# EAGLE design bombclock_1.0.1 (EAGLE 7.3.0)
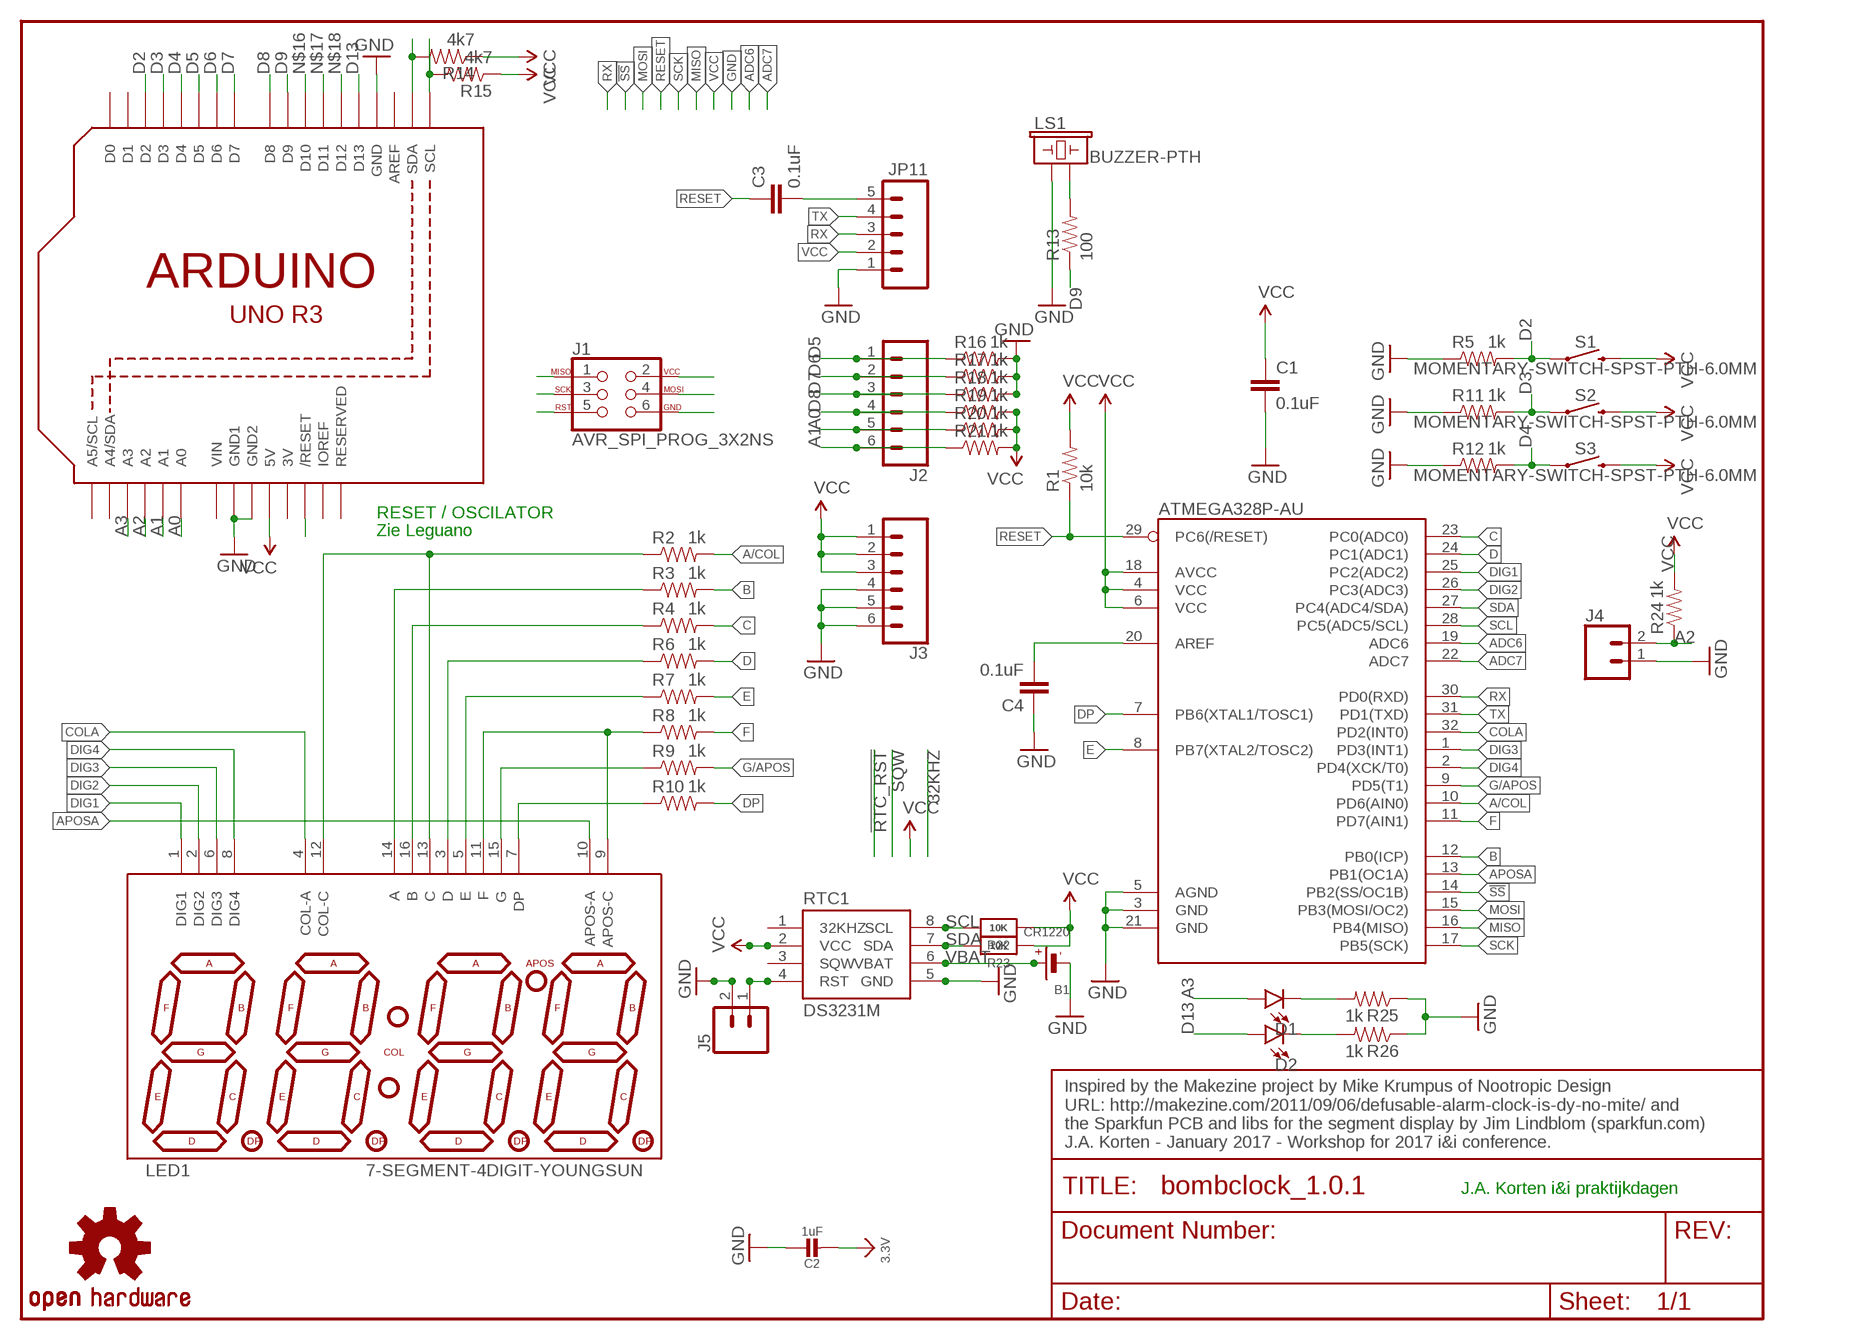
[diagram p0: schematic, sheet 1]

## Parts
ATMEGA328P-AU  ATMEGA328P-AU  ATMEGA168  [TQFP32-08]
B1  CR1220  BATTERYCR1220_SMT  [CR1220]
C1  0.1uF  CAP0402-CAP  [0402-CAP]
C2  1uF  CAP_CERAMIC0805-NOOUTLINE  [0805-NO]
C3  0.1uF  CAP0402-CAP  [0402-CAP]
C4  0.1uF  CAP0402-CAP  [0402-CAP]
D1  LED5MM  [LED_5MM]
D2  LED5MM  [LED_5MM]
J1  AVR_SPI_PROG_3X2NS  [2X3-NS]
J2  CONN_06SILK_FEMALE_PTH  [1X06]
J3  CONN_06SILK_FEMALE_PTH  [1X06]
J4  CONN_02  [1X02]
J5  CONN_02  [1X02]
JP11  M05PTH-NS  [1X05_NO_SILK]
LED1  7-SEGMENT-4DIGIT-YOUNGSUN  [7-SEGMENT-4DIGIT-YOUNGSUN]
LS1  BUZZER-PTH  [BUZZER-12MM]
R1  10k  RESISTOR0402-RES  [0402-RES]
R2  1k  RESISTOR0402-RES  [0402-RES]
R3  1k  RESISTOR0402-RES  [0402-RES]
R4  1k  RESISTOR0402-RES  [0402-RES]
R5  1k  RESISTOR0402-RES  [0402-RES]
R6  1k  RESISTOR0402-RES  [0402-RES]
R7  1k  RESISTOR0402-RES  [0402-RES]
R8  1k  RESISTOR0402-RES  [0402-RES]
R9  1k  RESISTOR0402-RES  [0402-RES]
R10  1k  RESISTOR0402-RES  [0402-RES]
R11  1k  RESISTOR0402-RES  [0402-RES]
R12  1k  RESISTOR0402-RES  [0402-RES]
R13  100  RESISTOR0402-RES  [0402-RES]
R14  4k7  RESISTOR0402-RES  [0402-RES]
R15  4k7  RESISTOR0402-RES  [0402-RES]
R16  1k  RESISTOR0402-RES  [0402-RES]
R17  1k  RESISTOR0402-RES  [0402-RES]
R18  1k  RESISTOR0402-RES  [0402-RES]
R19  1k  RESISTOR0402-RES  [0402-RES]
R20  1k  RESISTOR0402-RES  [0402-RES]
R21  1k  RESISTOR0402-RES  [0402-RES]
R22  10K  RESISTOR0805_NOOUTLINE  [0805-NO]
R23  10K  RESISTOR0805_NOOUTLINE  [0805-NO]
R24  1k  RESISTOR0402-RES  [0402-RES]
R25  1k  RESISTOR0402-RES  [0402-RES]
R26  1k  RESISTOR0402-RES  [0402-RES]
RTC1  DS3231M  [SO08]
S1  MOMENTARY-SWITCH-SPST-PTH-6.0MM  [TACTILE_SWITCH_PTH_6.0MM]
S2  MOMENTARY-SWITCH-SPST-PTH-6.0MM  [TACTILE_SWITCH_PTH_6.0MM]
S3  MOMENTARY-SWITCH-SPST-PTH-6.0MM  [TACTILE_SWITCH_PTH_6.0MM]
U1  ARDUINOR3-DIMENSION  [ARDUINOR3]
U$4  OSHW-LOGOS  [OSHW-LOGO-S]

## Nets
3.3V: C2.2
!SS: ATMEGA328P-AU.14(PB2(SS/OC1B))
A0: J2.5 R20.1 U1.A0
A1: J2.6 R21.1 U1.A1
A2: J4.2 R24.1 U1.A2
A3: D1.A U1.A3
A/COL: ATMEGA328P-AU.10(PD6(AIN0)) R2.2
ADC6: ATMEGA328P-AU.19(ADC6)
ADC7: ATMEGA328P-AU.22(ADC7)
APOSA: ATMEGA328P-AU.13(PB1(OC1A)) LED1.10(APOS-A)
B: ATMEGA328P-AU.12(PB0(ICP)) R3.2
C: ATMEGA328P-AU.23(PC0(ADC0)) R4.2
COLA: ATMEGA328P-AU.32(PD2(INT0)) LED1.4(COL-A)
D: ATMEGA328P-AU.24(PC1(ADC1)) R6.2
D2: R5.2 S1.1 U1.D2
D3: R11.2 S2.1 U1.D3
D4: R12.2 S3.1 U1.D4
D5: J2.1 R16.1 U1.D5
D6: J2.2 R17.1 U1.D6
D7: J2.3 R18.1 U1.D7
D8: J2.4 R19.1 U1.D8
D9: R13.1 U1.D9
D13: D2.A U1.D13
DIG1: ATMEGA328P-AU.25(PC2(ADC2)) LED1.1(DIG1)
DIG2: ATMEGA328P-AU.26(PC3(ADC3)) LED1.2(DIG2)
DIG3: ATMEGA328P-AU.1(PD3(INT1)) LED1.6(DIG3)
DIG4: ATMEGA328P-AU.2(PD4(XCK/T0)) LED1.8(DIG4)
DP: ATMEGA328P-AU.7(PB6(XTAL1/TOSC1)) R10.2
E: ATMEGA328P-AU.8(PB7(XTAL2/TOSC2)) R7.2
F: ATMEGA328P-AU.11(PD7(AIN1)) R8.2
G/APOS: ATMEGA328P-AU.9(PD5(T1)) R9.2
GND: ATMEGA328P-AU.3(GND) ATMEGA328P-AU.5(AGND) ATMEGA328P-AU.21(GND) B1.- C1.2 C2.1 C4.1 J1.6 J3.4 J3.5 J3.6 J4.1 J5.2 JP11.1 LS1.+ R5.1 R11.1 R12.1 R16.2 R17.2 R18.2 R25.1 R26.1 RTC1.5(GND) U1.GND U1.GND1 U1.GND2
MISO: ATMEGA328P-AU.16(PB4(MISO)) J1.1
MOSI: ATMEGA328P-AU.15(PB3(MOSI/OC2)) J1.4
N$1: ATMEGA328P-AU.20(AREF) C4.2
N$2: LED1.7(DP) R10.1
N$3: LED1.15(G) R9.1
N$4: LED1.9(APOS-C) LED1.11(F) R8.1
N$5: LED1.5(E) R7.1
N$6: LED1.3(D) R6.1
N$8: LED1.16(B) R4.1
N$9: LED1.14(A) R3.1
N$10: LED1.12(COL-C) LED1.13(C) R2.1
N$12: D1.K(C) R25.2
N$13: C3.2 JP11.5
N$14: D2.K(C) R26.2
N$16: U1.D10
N$17: U1.D11
N$18: U1.D12
N$20: LS1.- R13.2
PP: J5.1 RTC1.4(RST)
RESET: ATMEGA328P-AU.29(PC6(/RESET)) C3.1 J1.5 R1.1
RST_UNO: U1.RESET(/RESET)
RX: ATMEGA328P-AU.30(PD0(RXD)) JP11.3
SCK: ATMEGA328P-AU.17(PB5(SCK)) J1.3
SCL: ATMEGA328P-AU.28(PC5(ADC5/SCL)) R15.2 R22.2 RTC1.8(SCL) U1.SCL
SDA: ATMEGA328P-AU.27(PC4(ADC4/SDA)) R14.2 R23.2 RTC1.7(SDA) U1.SDA
TX: ATMEGA328P-AU.31(PD1(TXD)) JP11.4
VBAT: B1.+$1(+) RTC1.6(VBAT)
VCC: ATMEGA328P-AU.4(VCC) ATMEGA328P-AU.6(VCC) ATMEGA328P-AU.18(AVCC) C1.1 J1.2 J3.1 J3.2 J3.3 JP11.2 R1.2 R14.1 R15.1 R19.2 R20.2 R21.2 R22.1 R23.1 R24.2 RTC1.2(VCC) S1.3 S2.3 S3.3 U1.5V
Unconnected: RTC1.1(32KHZ) RTC1.3(SQW) U1.A4(A4/SDA) U1.A5(A5/SCL) U1.AREF U1.D0 U1.D1 U1.IOREF U1.RESERVED

## Notes on the sheet
- RESET / OSCILATOR
- Zie Leguano
- Inspired by the Makezine project by Mike Krumpus of Nootropic Design 
  URL: http://makezine.com/2011/09/06/defusable-alarm-clock-is-dy-no-mite/ and 
  the Sparkfun PCB and libs for the segment display by Jim Lindblom (sparkfun.com)
  J.A. Korten - January 2017 - Workshop for 2017 i&i conference.
- J.A. Korten i&i praktijkdagen

## Power pins joined to a net without a drawn wire
3V: U1.3V
VIN: U1.VIN

## Library data of the parts
ATMEGA328P-AU = SparkFun:ATMEGA168
B1 = microbuilder:BATTERY: CR1220 SMT - Digikey: 3001K-ND CD2032 BAT-HLD-001 - Digikey: BAT-HLD-001-ND
C1 = SparkFun:CAP: Capacitor Standard 0603 ceramic capacitor, and 0.1" leaded capacitor.
C2 = microbuilder:CAP_CERAMIC: Ceramic Capacitors For new designs, use the packages preceded by an '_' character since they are more reliable: The following footprints should be used on most boards: _0402 - Standard footprint for regular board layouts _0603 - Standard footprint for regular board layouts _0805 - Standard footprint for regular board layouts _1206 - Standard footprint for regular board layouts For extremely tight-pitch boards where space is at a premium, the following 'micro-pitch' footprints can be used (smaller pads, no silkscreen outline, etc.): _0402MP - Micro-pitch footprint for very dense/compact boards _0603MP - Micro-pitch footprint for very dense/compact boards _0805MP - Micro-pitch footprint for very dense/compact boards _1206MP - Micro-pitch footprint for very dense/compact boards
C3 C4 = SparkFun-Passives:CAP: Capacitor Standard 0603 ceramic capacitor, and 0.1" leaded capacitor.
D1 D2 = SparkFun-LED:LED: LED (Generic) Standard schematic elements and footprints for 5mm, 3mm, 1206, and 0603 sized LEDs. Generic LEDs with no color specified.
J1 = SparkFun-Connectors:AVR_SPI_PROG_3X2: AVR ISP 6 Pin This is the reduced ISP connector for AVR programming. Common on Arduino. This footprint will take up less PCB space and can be used with a 10-pin to 6-pin adapter such as SKU: BOB-08508 **Special note about "TEST_POINT" package. The stop mask is on the top side, so if you want your programming test points to be on the bottom of your board, make sure to place this package on the bottom side of the board. This also ensure that the orientation to program from the bottom side will be correct. SparkFun Products: SparkFun ISP Pogo Adapter <https://www.sparkfun.com/products/11591> - NS Tiny AVR Programmer <https://www.sparkfun.com/products/11801> -PTH
J2 J3 = SparkFun-Connectors:CONN_06: Multi connection point. Often used as Generic Header-pin footprint for 0.1 inch spaced/style header connections On any of the 0.1 inch spaced packages, you can populate with these: Break Away Headers - Straight <https://www.sparkfun.com/products/116> (PRT-00116) Break Away Male Headers - Right Angle <https://www.sparkfun.com/products/553> (PRT-00553) Female Headers <https://www.sparkfun.com/products/115> (PRT-00115) Break Away Headers - Machine Pin <https://www.sparkfun.com/products/117> (PRT-00117) Break Away Female Headers - Swiss Machine Pin <https://www.sparkfun.com/products/743> (PRT-00743) Arduino Stackable Header - 6 Pin <https://www.sparkfun.com/products/9280> (PRT-09280) For SCREWTERMINALS and SPRING TERMINALS visit here: Screw Terimnals on SparkFun.com <https://www.sparkfun.com/search/results?term=Screw+Terminals> (5mm/3.5mm/2.54mm spacing) This device is also useful as a general connection point to wire up your design to another part of your project. Our various solder wires solder well into these plated through hole pads. Hook-Up Wire - Assortment (Stranded, 22 AWG) <https://www.sparkfun.com/products/11375> (PRT-11375) Hook-Up Wire - Assortment (Solid Core, 22 AWG) <https://www.sparkfun.com/products/11367> (PRT-11367) View the entire wire category on our website here <https://www.sparkfun.com/categories/141>; PROD_ID: CONN-08437
J4 J5 = SparkFun-Connectors:CONN_02: Multi connection point. Often used as Generic Header-pin footprint for 0.1 inch spaced/style header connections On any of the 0.1 inch spaced packages, you can populate with these: Break Away Headers - Straight <https://www.sparkfun.com/products/116> (PRT-00116) Break Away Male Headers - Right Angle <https://www.sparkfun.com/products/553> (PRT-00553) Female Headers <https://www.sparkfun.com/products/115> (PRT-00115) Break Away Headers - Machine Pin <https://www.sparkfun.com/products/117> (PRT-00117) Break Away Female Headers - Swiss Machine Pin <https://www.sparkfun.com/products/743> (PRT-00743) For SCREWTERMINALS and SPRING TERMINALS visit here: Screw Terimnals on SparkFun.com <https://www.sparkfun.com/search/results?term=Screw+Terminals> (5mm/3.5mm/2.54mm spacing) This device is also useful as a general connection point to wire up your design to another part of your project. Our various solder wires solder well into these plated through hole pads. Hook-Up Wire - Assortment (Stranded, 22 AWG) <https://www.sparkfun.com/products/11375> (PRT-11375) Hook-Up Wire - Assortment (Solid Core, 22 AWG) <https://www.sparkfun.com/products/11367> (PRT-11367) View the entire wire category on our website here <https://www.sparkfun.com/categories/141> Special notes: Molex polarized connector foot print use with: PRT-08233 with associated crimp pins and housings. 2.54_SCREWTERM for use with PRT-10571. 3.5mm Screw Terminal footprints for PRT-08084 5mm Screw Terminal footprints for use with PRT-08432
JP11 = SparkFun-Connectors:M05: Header 5 Standard 5-pin 0.1" header. Use with straight break away headers (SKU : PRT-00116), right angle break away headers (PRT-00553), swiss pins (PRT-00743), machine pins (PRT-00117), and female headers (PRT-00115). Molex polarized connector foot print use with SKU : PRT-08230 with associated crimp pins and housings.
LED1 = SparkFun:7-SEGMENT-4DIGIT-YOUNGSUN: This is a part for the 4-Digit 7-segment LEDs from Young Sun. Different from the Digikey LEDs, all 16 pins are used. The LONGPADS Variant is used for a test jig, but you may like it because there is more pad to solder to. If you are concerned about routing space, the standard works just fine though.
LS1 = SparkFun-Electromechanical:BUZZER: Buzzer Small round buzzers that operate around the audible 2kHz range. You can use these as speakers to create simple music or user interfaces. Variant Overview: PTH - Mini Speaker - PC Mount 12mm 2.048kHz <https://www.sparkfun.com/products/7950> PTH_KIT - Mini Speaker - PC Mount 12mm 2.048kHz <https://www.sparkfun.com/products/7950> KIT simplifies soldering by adding stop mask to one side of the pads. PTH_NO_SILK - Mini Speaker - PC Mount 12mm 2.048kHz <https://www.sparkfun.com/products/7950> No silkscreen indicator of buzzer outline. PTH_KIT_NO_SILK - Mini Speaker - PC Mount 12mm 2.048kHz <https://www.sparkfun.com/products/7950> KIT package w/o silkscreen SMD - Buzzer Audio Magnetic (CCV-084B16) SMD buzzer used on, e.g. the LilyPad Buzzer <https://www.sparkfun.com/products/8463> and RFID USB Reader <https://www.sparkfun.com/products/9963>. SMD_KIT - Buzzer Audio Magnetic (CCV-084B16) SMD Buzzer with elongated pins to make soldering easier. Used on the SparkFun Simon Says - Surface Mount Soldering Kit <https://www.sparkfun.com/products/10935>.; PROD_ID: COMP-08253; SF_SKU: COM-07950
R1-R21 R24-R26 = SparkFun:RESISTOR: Resistor Basic schematic elements and footprints for 0603, 1206, and PTH 1/10th watt (small) resistors.
R22 R23 = microbuilder:RESISTOR: Resistors For new designs, use the packages preceded by an '_' character since they are more reliable: The following footprints should be used on most boards: _0402 - Standard footprint for regular board layouts _0603 - Standard footprint for regular board layouts _0805 - Standard footprint for regular board layouts _1206 - Standard footprint for regular board layouts For extremely tight-pitch boards where space is at a premium, the following 'micro-pitch' footprints can be used (smaller pads, no silkscreen outline, etc.): _0402MP - Micro-pitch footprint for very dense/compact boards _0603MP - Micro-pitch footprint for very dense/compact boards _0805MP - Micro-pitch footprint for very dense/compact boards _1206MP - Micro-pitch footprint for very dense/compact boards
RTC1 = SparkFun-Clocks:DS3231M: DS3231M Real Time Clock Accuracy +/-5ppm. Battery Backup. 2.3V to 5.5V. Datasheet <https://cdn.sparkfun.com/datasheets/Dev/Beagle/DS3231M.pdf> SparkFun Products CryptoCape <https://www.sparkfun.com/products/12773> (DEV-12773) SparkFun CryptoShield <https://www.sparkfun.com/products/13183> (DEV-13183); PROD_ID: IC-11985
S1-S3 = SparkFun-Switches:MOMENTARY-SWITCH-SPST: Momentary Switch (Pushbutton) - SPST Normally-open (NO) SPST momentary switches (buttons, pushbuttons). Variants PTH-12MM - 12mm square, through-hole Momentary Pushbutton Switch - 12mm Square <https://www.sparkfun.com/products/9190> (COM-09190) PTH-6.0MM, PTH-6.0MM-KIT - 6.0mm square, through-hole Mini Pushbutton Switch <https://www.sparkfun.com/products/97> (COM-00097) KIT package intended for soldering kit's - only one side of pads' copper is exposed. PTH-RIGHT-ANGLE-KIT - Right-angle, through-hole Right Angle Tactile Button <https://www.sparkfun.com/products/10791> - Used on SparkFun BigTime Watch Kit <https://www.sparkfun.com/products/11734> SMD-12MM - 12mm square, surface-mount Tactile Button - SMD (12mm) <https://www.sparkfun.com/products/12993> (COM-12993) Used on SparkFun PicoBoard <https://www.sparkfun.com/products/11888> SMD-4.5MM - 4.5mm Square Trackball Switch Used on SparkFun Blackberry Trackballer Breakout <https://www.sparkfun.com/products/13169> SMD-4.6MMX2.8MM - 4.60mm x 2.80mm, surface mount Used on SparkFun SAMD21 Mini Breakout <https://www.sparkfun.com/products/13664> SMD-5.2MM, SMD-5.2-REDUNDANT - 5.2mm square, surface-mount Mini Pushbutton Switch - SMD <https://www.sparkfun.com/products/8720> (COM-08720) Used on Arduino Pro Mini <https://www.sparkfun.com/products/11114> REDUNDANT package connects both switch circuits together SMD-6.0X3.5MM - 6.0 x 3.5mm, surface mount Momentary Reset Switch SMD <https://www.sparkfun.com/products/8229> (COM-08229) SMD-6.2MM-TALL - 6.2mm square, surface mount Tactile Button - SMD (6mm) <https://www.sparkfun.com/products/12992> Used on SparkFun Digital Sandbox <https://www.sparkfun.com/products/12651> SMD-RIGHT-ANGLE - Right-angle, surface mount Used on SparkFun Block for Intel® Edison - Arduino <https://www.sparkfun.com/products/13036>; PROD_ID: SWCH-08441; SF_SKU: COM-00097
U1 = adafruit:ARDUINOR3: This is a new object for the new Arduino R3 - with extra pins that you may want to use (such as IOref, and duplicated A4/A5
U$4 = SparkFun-Aesthetics:OSHW-LOGO: Open Source Hardware Logo This logo indicates the piece of hardware it is found on incorporates a OSHW license and/or adheres to the definition of open source hardware found here: http://freedomdefined.org/OSHW

## Board
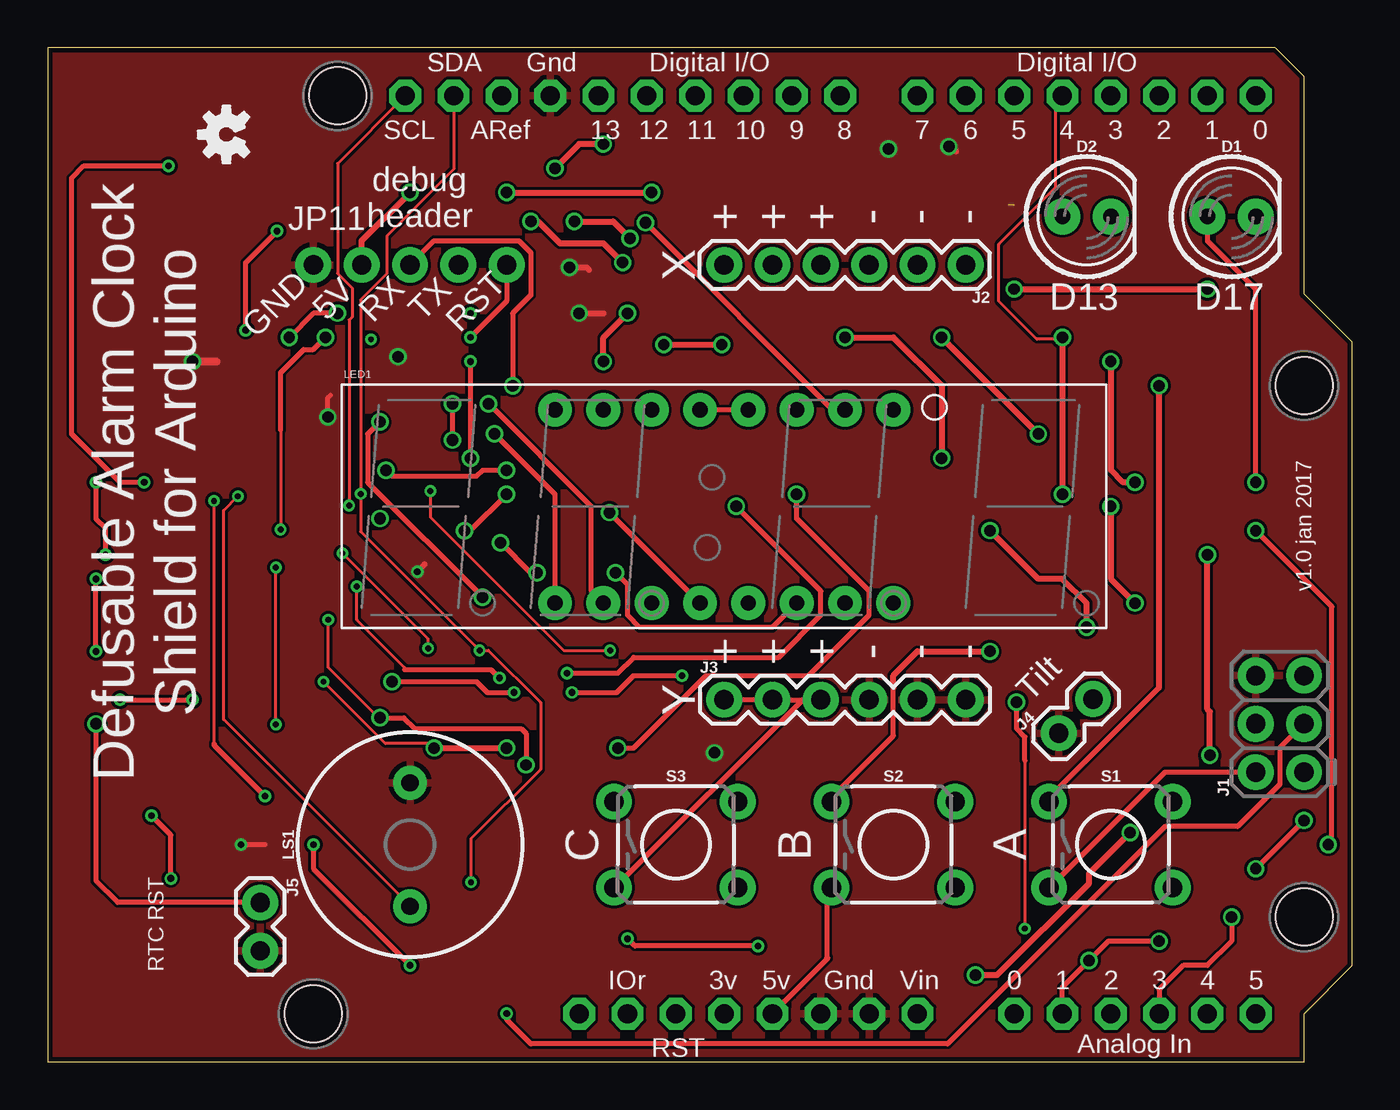
[diagram p1: board, top side]
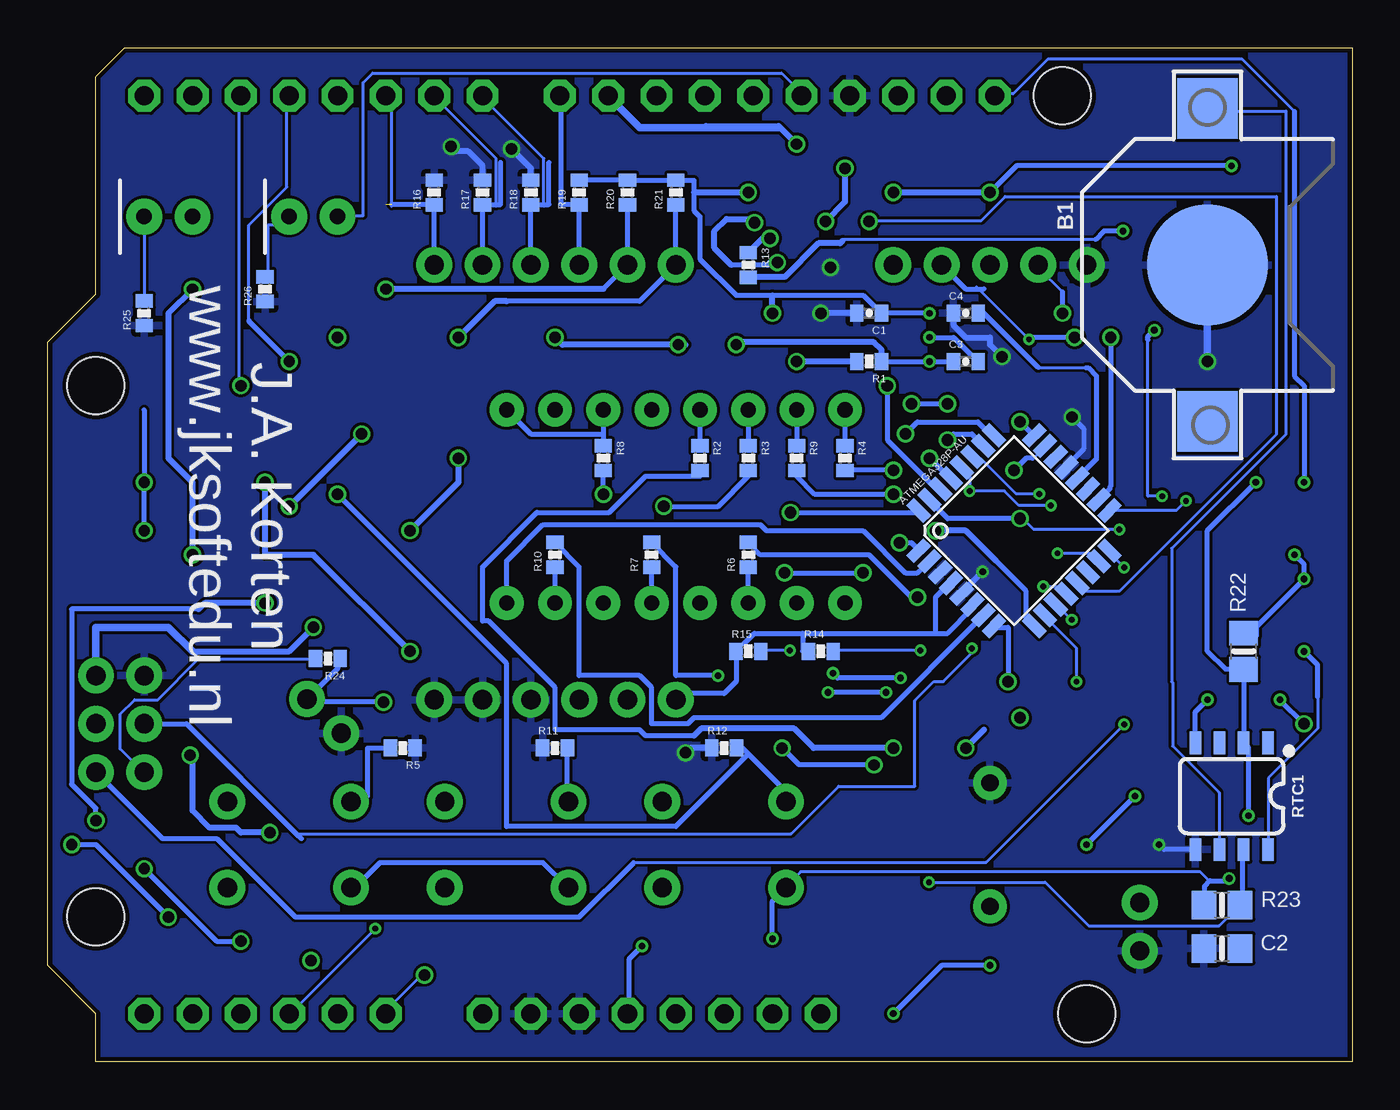
[diagram p2: board, bottom side, seen from below]

Size 68.58 x 53.34 mm. Coordinates in mm from the lower left corner, seen from the top.
Copper layers (1*16): Top 0.035mm / dielectric 1.5mm / Bottom 0.035mm
Design rules "ITEADstudioDRC": minimum track width 6mil, minimum drill 12mil, track to track 6mil, track to pad 6mil, pad to pad 6mil, via to via 6mil, smd to smd 0mil, copper to edge 10mil, drill to drill 10mil, minimum pad ring 10mil, minimum via ring 6mil, stop-mask expansion 2mil, vias tented up to drill 100mil, thermal gap 10mil
Holes 3 mm at 66.04,35.56 66.04,7.62 15.24,50.8 13.97,2.54

### Footprints (pad centres in the part's own frame; a part is rotated, then mirrored left to right if it is on the bottom)
TQFP32-08 = smd 1.27 x 0.559: 1 -4.293,2.8; 2 -4.293,2; 3 -4.293,1.2; 4 -4.293,0.4; 5 -4.293,-0.4; 6 -4.293,-1.2; 7 -4.293,-2; 8 -4.293,-2.8; 17 4.293,-2.8; 18 4.293,-2; 19 4.293,-1.2; 20 4.293,-0.4; 21 4.293,0.4; 22 4.293,1.2; 23 4.293,2; 24 4.293,2.8 | smd 0.559 x 1.27: 9 -2.8,-4.293; 10 -2,-4.293; 11 -1.2,-4.293; 12 -0.4,-4.293; 13 0.4,-4.293; 14 1.2,-4.293; 15 2,-4.293; 16 2.8,-4.293; 25 2.8,4.293; 26 2,4.293; 27 1.2,4.293; 28 0.4,4.293; 29 -0.4,4.293; 30 -1.2,4.293; 31 -2,4.293; 32 -2.8,4.293
CR1220 = smd 3.2 x 3.2: +$1 -8.225,0; +$2 8.225,0 | smd 6.35 x 6.35: - 0,0
0402-CAP = smd 0.7 x 0.9: 1 -0.65,0; 2 0.65,0
0805-NO = smd 1.3 x 1.5: 1 -0.95,0; 2 0.95,0
LED_5MM = drill 0.813 pad 1.88: A -1.27,0; K 1.27,0
2X3-NS = drill 1.016 pad 1.88: 1 -2.54,-1.27; 2 -2.54,1.27; 3 0,-1.27; 4 0,1.27; 5 2.54,-1.27; 6 2.54,1.27
1X06 = drill 1.016 pad 1.88: 1 0,0; 2 2.54,0; 3 5.08,0; 4 7.62,0; 5 10.16,0; 6 12.7,0
1X02 = drill 1.016 pad 1.88: 1 0,0; 2 2.54,0
1X05_NO_SILK = drill 1.016 pad 1.88: 1 0,0; 2 2.54,0; 3 5.08,0; 4 7.62,0; 5 10.16,0
7-SEGMENT-4DIGIT-YOUNGSUN = drill 0.8 pad 1.778: 1 -8.89,-5.08; 2 -6.35,-5.08; 3 -3.81,-5.08; 4 -1.27,-5.08; 5 1.27,-5.08; 6 3.81,-5.08; 7 6.35,-5.08; 8 8.89,-5.08; 9 8.89,5.08; 10 6.35,5.08; 11 3.81,5.08; 12 1.27,5.08; 13 -1.27,5.08; 14 -3.81,5.08; 15 -6.35,5.08; 16 -8.89,5.08
BUZZER-12MM = drill 0.9 pad 1.778: + 3.25,0; - -3.25,0
0402-RES = smd 0.7 x 0.9: 1 -0.65,0; 2 0.65,0
SO08 = smd 0.6 x 1.2: 1 -1.905,-2.8; 2 -0.635,-2.8; 3 0.635,-2.8; 4 1.905,-2.8; 5 1.905,2.8; 6 0.635,2.8; 7 -0.635,2.8; 8 -1.905,2.8
TACTILE_SWITCH_PTH_6.0MM = drill 1.016 pad 1.88: 1 -3.251,2.261; 2 3.251,2.261; 3 -3.251,-2.261; 4 3.251,-2.261
ARDUINOR3 = drill 1 pad 1.676 octagon: 3V 35.56,2.54; 5V 38.1,2.54; A0 50.8,2.54; A1 53.34,2.54; A2 55.88,2.54; A3 58.42,2.54; A4 60.96,2.54; A5 63.5,2.54; AREF 23.876,50.8; D0 63.5,50.8; D1 60.96,50.8; D2 58.42,50.8; D3 55.88,50.8; D4 53.34,50.8; D5 50.8,50.8; D6 48.26,50.8; D7 45.72,50.8; D8 41.656,50.8; D9 39.116,50.8; D10 36.576,50.8; D11 34.036,50.8; D12 31.496,50.8; D13 28.956,50.8; GND 26.416,50.8; GND1 43.18,2.54; GND2 40.64,2.54; IOREF 30.48,2.54; RESERVED 27.94,2.54; RESET 33.02,2.54; SCL 18.796,50.8; SDA 21.336,50.8; VIN 45.72,2.54

### Placement (x,y rotation side)
ATMEGA328P-AU  17.78,27.94 45 bottom
B1  7.62,41.91 270 bottom
C1  25.4,39.37 180 bottom
C2  6.86,5.97 0 bottom
C3  20.32,36.83 0 bottom
C4  20.32,39.37 0 bottom
D1  62.23,44.45 0 top
D2  54.61,44.45 0 top
J1  64.77,17.78 90 top
J2  48.26,41.91 180 top
J3  35.56,19.05 0 top
J4  53.14,17.29 45 top
J5  11.18,8.38 270 top
JP11  13.97,41.91 0 top
LED1  35.56,29.21 0 top
LS1  19.05,11.43 90 top
R1  25.4,36.83 180 bottom
R2  34.29,31.75 270 bottom
R3  31.75,31.75 270 bottom
R4  26.67,31.75 270 bottom
R5  49.91,16.51 180 bottom
R6  31.75,26.67 90 bottom
R7  36.83,26.67 90 bottom
R8  39.37,31.75 270 bottom
R9  29.21,31.75 270 bottom
R10  41.91,26.67 90 bottom
R11  41.91,16.51 0 bottom
R12  33.02,16.51 0 bottom
R13  31.75,41.91 270 bottom
R14  27.94,21.59 0 bottom
R15  31.75,21.59 0 bottom
R16  48.26,45.72 90 bottom
R17  45.72,45.72 90 bottom
R18  43.18,45.72 90 bottom
R19  40.64,45.72 90 bottom
R20  38.1,45.72 90 bottom
R21  35.56,45.72 90 bottom
R22  5.71,21.59 90 bottom
R23  6.86,8.26 0 bottom
R24  53.85,21.21 180 bottom
R25  63.5,39.37 90 bottom
R26  57.15,40.64 90 bottom
RTC1  6.35,13.97 180 bottom
S1  55.88,11.43 0 top
S2  44.45,11.43 0 top
S3  33.02,11.43 0 top
U1  0,0 0 top
U$4  9.4,48.77 90 top

### Tracks (layer width: path | path; a pad name or v marks a point on that pad's centre or on a via)
A0  (via drill 0.6)
  Top 0.305: v50.8,40.64 v60.96,40.64 | v48.77,4.57 49.91,4.57 54.74,9.4 54.74,9.91 v56.9,12.06 | v61.09,16.13 61.09,18.41 60.96,18.54 v60.96,26.67
  Bottom 0.152: U1.A0 50.5,3 49,4.5 v48.77,4.57
  Bottom 0.254: R20.1 J2.5 39.37,40.64
  Bottom 0.305: 39.37,40.64 v50.8,40.64 | v60.96,40.64 62.23,39.37 62.23,31.75 60.96,30.48 v60.96,26.67 | v56.9,12.06 58.42,12.06 58.67,12.32 60.07,12.32 60.96,13.21 60.96,16 v61.09,16.13
A1  (via drill 0.6)
  Top 0.254: U1.A1 53.34,3.94 v54.74,5.33 55.75,6.35 v58.42,6.35 | v63.5,10.16 v66.04,12.7
  Top 0.305: v46.99,38.1 v52.07,33.02 | v55.88,29.21 55.88,25.4 v57.15,24.13
  Bottom 0.254: R21.1 J2.6 37.47,40.01 44.45,40.01 | 60.64,23.81 67.31,23.81 67.31,14.61 66.04,13.34 v66.04,12.7 | v63.5,10.16 59.69,6.35 v58.42,6.35
  Bottom 0.305: 44.45,40.01 45.09,40.01 v46.99,38.1 | v52.07,33.02 v55.88,29.21 | v57.15,24.13 60.33,24.13 60.64,23.81
A2  (via drill 0.3, 0.6)
  Top 0.152: 51.36,15.85 v51.36,7.01
  Top 0.254: 51.36,15.85 51.36,17.09 50.93,17.53 v50.93,18.92
  Bottom 0.152: 53.34,21.18 R24.1 | 54.56,19.05 J4.2 | v51.36,7.01 55.78,2.59 U1.A2
  Bottom 0.254: v50.93,18.92 54.78,18.92 J4.2 53.34,20.68 53.34,21.18
A3  (via drill 0.6)
  Top 0.254: v67.31,11.43 67.5,11.62 67.5,23.94 v63.5,27.94 | v62.23,7.62 62.23,6.35 60.96,5.08 59.69,5.08 58.42,3.81 U1.A3 | v63.5,30.48 63.5,40.64 60.96,43.18 D1.A
  Bottom 0.254: v67.31,11.43 66.04,11.43 v62.23,7.62 | v63.5,27.94 v63.5,30.48 63.5,34.29
A/COL  (via drill 0.3, 0.6)
  Top 0.152: v14.5,20 17.75,16.75 20.25,16.75 v20.32,16.51
  Top 0.305: v20.32,16.51 v24.13,16.51
  Bottom 0.152: v14.5,20 14.5,21.75 16,23.25 ATMEGA328P-AU.10
  Bottom 0.254: 34.29,17.46 34.61,17.14 37.15,17.14 37.47,17.46 41.91,17.46 41.91,19.68 45.4,23.18 45.72,23.18 45.72,26.04 42.86,28.89 39.05,28.89 37.15,30.8 34.29,30.8 R2.2
  Bottom 0.305: 19.37,17.46 v20.32,16.51 | v24.13,16.51 28.32,16.51 29.34,17.53 34.23,17.53 34.61,17.14
APOSA  (via drill 0.6, 0.61)
  Top 0.254: v31.43,44.13 41.27,34.29 LED1.10
  Top 0.305: v25.4,44.2 25.78,44.2 26.92,43.05 29.21,43.05 v30.23,42.04
  Bottom 0.152: ATMEGA328P-AU.13 14.25,25 14,24.75 12.25,24.75 4,33 4,45.5 18.25,45.5 19.5,44.25 25.25,44.25 v25.4,44.2
  Bottom 0.254: 30.73,41.91 32.64,41.91
  Bottom 0.305: 25.34,44.13 v25.4,44.2 | v30.23,42.04 30.61,42.04 30.73,41.91 | 32.64,41.91 33.53,42.8 33.53,43.69 32.89,44.32 31.62,44.32 v31.43,44.13
B  (via drill 0.3, 0.35, 0.61)
  Top 0.152: v16.25,25 16.25,23.25 18.75,20.75 18.75,20.64
  Top 0.254: v36.2,29.21 40.64,24.77 40.64,23.5 38.42,21.27 30.8,21.27 29.97,20.45 v27.3,20.45 | 18.75,20.64 23.3,20.64 v23.75,20.19
  Bottom 0.152: v16.25,25 15.5,25 15.25,24.75 ATMEGA328P-AU.12
  Bottom 0.254: v36.2,29.21 33.34,29.21 31.75,30.8 R3.2 | v23.75,20.19 27.05,20.19 v27.3,20.45
C  (via drill 0.61)
  Top 0.254: v24.13,31.11 22.86,31.11 22.54,30.8 18.1,30.8 v17.78,31.11
  Bottom 0.152: ATMEGA328P-AU.23 16.25,32.25 16.75,31.75 16.83,31.75
  Bottom 0.254: v24.13,31.11 26.67,31.11 R4.2 | v17.78,31.11 17.14,31.75 16.83,31.75
COLA  (via drill 0.61)
  Top 0.254: LED1.4 v29.53,28.89
  Bottom 0.254: v29.53,28.89 22.86,28.89 ATMEGA328P-AU.32
D  (via drill 0.61)
  Top 0.254: v22.86,24.45 16.83,30.48 16.83,33.02 v17.46,33.66
  Bottom 0.254: v22.86,24.45 23.18,24.45 25.4,26.67 31.11,26.67 31.75,27.3 R6.2 | v17.46,33.66 16.83,33.02 ATMEGA328P-AU.24
D2  (via drill 0.6)
  Top 0.254: 58.42,19.68 52.7,13.97 S1.1
  Top 0.305: 58.42,19.68 v58.42,35.56
  Bottom 0.152: U1.D2 58.5,50.5 58.5,36 v58.42,35.56
  Bottom 0.254: R5.2 51.75,16.51 51.75,13.97 52.39,13.97 S1.1
D3  (via drill 0.6)
  Top 0.254: 44.45,19.68 44.45,17.14 41.27,13.97 S2.1
  Top 0.305: 44.45,19.68 44.45,20.32 45.72,21.59 v49.53,21.59 | v57.15,30.48 56.52,30.48 55.88,31.11 v55.88,36.83
  Bottom 0.152: 58,39 58,44 56,46 56,50.5 U1.D3
  Bottom 0.254: R11.2 41.27,16.51 41.27,13.97 S2.1 | 58,39 58,38.95 v55.88,36.83
  Bottom 0.305: v49.53,21.59 54.61,26.67 57.15,26.67 v57.15,30.48
D4  (via drill 0.6, 0.61)
  Top 0.152: U1.D4 53,50.5 53,46 50,43 50,40 52,38 53,38 v53.34,38.1
  Top 0.305: v53.34,38.1 v53.34,29.84
  Bottom 0.152: 53.5,50.5 U1.D4 | 53.5,38.5 v53.34,38.1
  Bottom 0.254: 31.75,16.19 29.53,13.97 S3.1 | 31.75,16.19 32.07,16.51 R12.2 | v53.34,29.84 44.45,20.95 44.45,12.38 35.56,12.38 31.75,16.19
D5  (1 unrouted)
  Bottom 0.152: U1.D5 50.5,50.5 50.5,45.09 50.5,45
  Bottom 0.254: J2.1 R16.1 48.26,45.09 50.5,45.09
D6
  Bottom 0.152: U1.D6 48,50.5 45,47.5 45,45.09 45,45
  Bottom 0.254: J2.2 R17.1 45.72,45.09 45,45.09 44.77,45.09 44.77,47.31
D7
  Bottom 0.152: U1.D7 45.5,50.5 42.5,47.5 42.5,45.09 42.5,45
  Bottom 0.254: J2.3 R18.1 43.18,45.09 42.5,45.09 42.23,45.09 42.23,47.31
D8
  Bottom 0.152: U1.D8 41.5,50.5 41.59,50.5
  Bottom 0.254: J2.4 R19.1 40.64,45.09 41.59,45.09 41.59,50.5 41.59,50.8
D9  (via drill 0.6)
  Top 0.305: v29.21,48.26 27.94,48.26 v26.67,46.99 | v27.69,44.2 29.72,44.2 v30.61,43.31
  Bottom 0.152: U1.D9 39,50.5 37.5,49 30,49 29.98,49.02
  Bottom 0.254: 33.97,49.21 37.47,49.21 39.05,50.8
  Bottom 0.305: 33.97,49.21 30.16,49.21 29.98,49.02 v29.21,48.26 | v26.67,46.99 26.67,45.21 v27.69,44.2 | v30.61,43.31 31,43.31 R13.1
D13
  Bottom 0.152: U1.D13 29,51 30,52 51.5,52 52,51.5 52,44.5 53,44.5 D2.A
DIG1  (via drill 0.61)
  Top 0.254: v23.5,33.02 26.67,29.84 LED1.1
  Bottom 0.254: v23.5,33.02 22.86,33.66 19.68,33.66 19.05,33.02 ATMEGA328P-AU.25
DIG2  (via drill 0.61)
  Top 0.254: v21.27,34.61 v21.27,32.7 | v23.18,34.61 28.57,29.21 28.57,24.77 LED1.2
  Bottom 0.254: v21.27,32.7 20.95,33.02 20,33.02 19.68,32.7 ATMEGA328P-AU.26 | v23.18,34.61 v21.27,34.61
DIG3  (via drill 0.61)
  Top 0.254: v23.81,27.3 25.4,25.72 v25.72,25.72 | v29.84,25.72 30.48,25.08 30.48,23.5 31.11,22.86 38.1,22.86 LED1.6
  Bottom 0.254: v23.81,27.3 23.18,27.3 22.86,26.99 ATMEGA328P-AU.1 | v29.84,25.72 v25.72,25.72
DIG4
  Bottom 0.254: LED1.8 44.45,26.35 42.55,28.26 31.11,28.26 30.8,27.94 25.72,27.94 23.5,25.72 22.86,25.72 22.54,26.04 ATMEGA328P-AU.2
DP
  Bottom 0.254: R10.2 41.91,27.3 40.64,26.04 40.64,20.32 37.47,20.32 36.83,19.68 36.83,17.78 34.92,17.78 34.61,18.1 24.77,18.1 19.68,23.18 ATMEGA328P-AU.7
E  (via drill 0.35, 0.61)
  Top 0.254: v33.34,20.32 30.8,20.32 29.91,19.43 v27.56,19.43 | v18.1,20 22.54,20 23.11,19.43 v24.51,19.43
  Bottom 0.254: v33.34,20.32 35.56,20.32 35.56,26.04 36.83,27.3 R7.2 | v18.1,20 18.1,22.86 18.73,22.86 ATMEGA328P-AU.8 | v24.51,19.43 v27.56,19.43
F  (via drill 0.3, 0.6, 0.61)
  Top 0.152: v14.75,23.25 14.75,20.75 17.25,18.25 v17.46,18.1
  Top 0.254: v39.37,29.84 39.37,28.57 43.18,24.77 43.18,23.5 40.01,20.32 34.61,20.32 30.8,16.51 v29.97,16.51 | v17.46,18.1 18.73,18.1 19.3,17.53 24.89,17.53 25.15,17.27 v25.15,15.62
  Bottom 0.152: v14.75,23.25 15.5,24 ATMEGA328P-AU.11
  Bottom 0.254: v39.37,29.84 R8.2 | v25.15,15.62 29.08,15.62 v29.97,16.51
G/APOS  (via drill 0.61)
  Top 0.254: v24.13,29.84 22.23,27.94 v21.91,27.94
  Bottom 0.254: v24.13,29.84 28.26,29.84 29.21,30.8 R9.2 | 18.73,26.35 17.14,24.77 17.14,23.18 16.83,23.18 ATMEGA328P-AU.9
  Bottom 0.305: 18.73,26.35 20.32,27.94 v21.91,27.94
GND  (via drill 0.35, 0.6)
  Top 0.254: v14.73,33.91 14.73,34.92 14.86,35.05 | v10.16,11.43 11.43,11.43
  Top 0.305: v27.94,39.37 29.21,39.37 | v47.37,48.13 47.5,48.13 47.75,47.88 | v44.2,48.01 44.2,47.88 44.07,47.75 | v35.05,16.26 35.05,16 | v19.43,25.78 19.81,26.16 | v27.43,41.78 28.32,41.78 28.45,41.66
  Top 0.406: v7.62,36.83 8.89,36.83
  Bottom 0.254: ATMEGA328P-AU.21 15.03,31.33 14.1,32.26 14.1,33.27 v14.73,33.91 | RTC1.5 9.9,11.17 v10.16,11.43
  Bottom 0.305: C1.2 v27.94,39.37 | R17.2 45.72,47.12 46.48,47.88 47.12,47.88 v47.37,48.13 | R18.2 43.18,46.99 v44.2,48.01 | R12.1 34.8,16.51 v35.05,16.26 | ATMEGA328P-AU.5 20.53,24.68 v19.43,25.78 | C4.1 20.97,38.75 20.32,38.1 19.05,38.1 19.05,37.72 v18.41,37.08
  Bottom 0.406: B1.- v7.62,36.83
  pour Bottom: 0,53.34 68.58,53.34 68.58,0 0,0
  pour Top: 0,0 0,53.34 68.58,53.34 68.58,0
MISO  (via drill 0.3)
  Top 0.152: v12,17.75 v12,26
  Bottom 0.152: v12,26 12.75,26.75 ATMEGA328P-AU.16 | v12,17.75 19.25,10.5 37.75,10.5 37.78,10.48
  Bottom 0.254: 37.78,10.48 40.64,7.62 55.56,7.62 59.69,11.75 62.55,11.75 J1.1
MOSI  (via drill 0.3)
  Top 0.152: v15.5,26.75 20,22.25 v20,21.75
  Bottom 0.152: v15.5,26.75 13.75,26.75 13.5,26.5 ATMEGA328P-AU.15 | 55.5,12 29.5,12 27,14.5 23,14.5 23,19 22,20 21.5,20 20,21.5 v20,21.75
  Bottom 0.254: 55.24,11.75 55.5,12 61.28,17.78 J1.4
N$1
  Bottom 0.152: 14,36.5 16.5,36.5 16.51,36.51 | 14.25,30.75 ATMEGA328P-AU.20
  Bottom 0.254: 16.51,36.51 19.37,39.37 C4.2 | 14,36.5 13.89,36.5 13.46,36.07 13.46,31.69 ATMEGA328P-AU.20
N$2
  Bottom 0.254: LED1.7 R10.1
N$3
  Bottom 0.254: LED1.15 R9.1
N$4
  Bottom 0.254: LED1.11 39.37,33.02 | 39.37,33.02 R8.1 | 39.37,33.02 43.18,33.02 LED1.9
N$5
  Bottom 0.254: LED1.5 R7.1
N$6
  Bottom 0.254: LED1.3 R6.1
N$8
  Bottom 0.254: LED1.16 R4.1
N$9
  Bottom 0.254: LED1.14 R3.1
N$10
  Top 0.254: LED1.12 LED1.13
  Bottom 0.254: LED1.13 R2.1
N$12
  Bottom 0.152: D1.K R25.2 63.5,40
N$13  (via drill 0.35)
  Top 0.254: v22.23,38.1 24.13,40.01 JP11.5
  Bottom 0.254: v22.23,38.1 20.95,38.1 19.68,36.83 C3.2
N$14
  Bottom 0.152: R26.2 57,41.5 57,44 56,44 D2.K
N$20  (via drill 0.3, 0.35)
  Top 0.152: v10,29.75 9.25,29 9.25,18 19,8.25 LS1.-
  Top 0.254: 19.05,8.26 LS1.- | v10.41,38.48 10.41,42.04 v12.06,43.69
  Bottom 0.152: 13.5,43.25 26.75,43.25 26.8,43.18 | 10.75,37.96 10.75,29.75 v10,29.75
  Bottom 0.254: 31.75,41.27 R13.2 | 10.75,37.96 10.75,38.15 v10.41,38.48 | v12.06,43.69 13.06,43.69 13.5,43.25
  Bottom 0.305: 26.8,43.18 26.92,43.05 28.07,43.05 29.84,41.27 31.73,41.27 R13.2
PP  (via drill 0.35, 0.6)
  Top 0.254: v2.54,17.78 2.54,9.53 3.68,8.38 J5.1 | v3.81,19.05 v7.62,19.05
  Bottom 0.254: RTC1.4 8.26,18.41 v7.62,19.05 | v3.81,19.05 v2.54,17.78
RESET  (via drill 0.35, 0.6, 0.61)
  Top 0.254: v22.23,36.83 v22.23,31.75
  Top 0.305: v54.61,22.86 54.61,24.13 53.34,25.4 52.07,25.4 v49.53,27.94 | v32.38,37.72 v35.43,37.72 | v41.91,38.1 44.45,38.1 46.99,35.56 v46.99,31.75
  Bottom 0.254: R1.1 v22.23,36.83 C3.1 | v22.23,31.75 21.27,30.8 ATMEGA328P-AU.29
  Bottom 0.305: 60.96,21.59 55.88,21.59 v54.61,22.86 | R1.1 24.75,37.45 25.15,37.85 32.26,37.85 v32.38,37.72 | 35.05,37.72 v35.43,37.72 41.53,37.72 v41.91,38.1 | v46.99,31.75 46.99,30.48 v49.53,27.94
  Bottom 0.406: J1.5 66.04,22.86 62.23,22.86 60.96,21.59
RX  (via drill 0.61)
  Top 0.254: v24.45,35.56 24.45,39.37 25.4,40.32 25.4,42.55 24.77,43.18 20.32,43.18 JP11.3
  Bottom 0.254: v24.45,35.56 24.45,32.7 21.91,30.16 ATMEGA328P-AU.30
SCK  (via drill 0.3, 0.35)
  Top 0.152: 8.75,16.75 v8.75,29.5
  Top 0.254: J1.3 64.77,16.51 64.77,14.61 62.55,12.38 58.74,12.38 47.31,0.95 25.4,0.95 24.13,2.22 v24.13,2.54 | 8.75,16.75 8.75,16.65 v11.43,13.97 | v13.97,11.43 13.97,10.16 v19.05,5.08
  Bottom 0.152: v8.75,29.5 9.25,29 ATMEGA328P-AU.17
  Bottom 0.254: v11.43,13.97 v13.97,11.43 | v19.05,5.08 21.59,5.08 v24.13,2.54
SCL  (via drill 0.3, 0.35)
  Top 0.152: v29.57,21.64 27.13,21.64 20.12,28.65 v20.12,30.02 | v15.85,29.26 15.85,39.01 16,39.17 16,40.69 15.24,41.45 15.24,47.24 U1.SCL
  Top 0.254: v2.54,21.59 v2.54,25.4 | v2.54,30.48 2.54,28.57 3.05,28.07 v3.05,26.67
  Bottom 0.152: v29.57,21.64 31.09,21.64 R15.2 | ATMEGA328P-AU.28 20.42,31.24 20.12,30.94 v20.12,30.02 18.29,30.02 17.53,29.26 v15.85,29.26 | 1.83,19.2 1.83,17.53 4.42,14.94 4.42,11.28 RTC1.8 | 3.05,49.99 5.79,52.73 16,52.73 17.83,50.9 18.75,50.9 U1.SCL | 5.64,22.4 5.03,22.4 R22.2 5.64,22.4
  Bottom 0.254: 1.83,19.2 1.83,20.88 v2.54,21.59 | v3.05,26.67 2.54,26.16 v2.54,25.4 5.03,22.91 5.03,22.4 | 3.05,49.99 3.05,36.07 2.54,35.56 v2.54,30.48
SDA  (via drill 0.3)
  Top 0.152: U1.SDA 21.34,46.94 17.83,43.43 17.83,41.45 16.46,40.08 v16.46,29.87 16.46,27.89 v22.71,21.64 23.16,21.64 25.91,18.9 25.91,15.39 22.25,11.73 v22.25,9.45
  Bottom 0.152: v22.71,21.64 27.28,21.64 R14.2 | v16.46,29.87 17.68,29.87 19.51,31.7 19.96,31.7 ATMEGA328P-AU.27 | v22.25,9.45 16.15,9.45 13.87,7.16 7.01,7.16 5.94,8.23 R23.2 5.79,8.38 | 5.79,11.12 RTC1.7
  Bottom 0.254: 5.79,11.12 5.79,8.37 R23.2
TX  (via drill 0.3, 0.6, 0.61)
  Top 0.152: 12.25,33.25 v12.25,28
  Top 0.254: 12.25,33.25 12.25,36.25 13.46,37.47 13.97,37.47 v14.61,38.1
  Bottom 0.152: v12.25,28 16.75,28 17.25,28.5 v17.46,28.57 | v17,38 19.75,40.75 19.75,40.64
  Bottom 0.254: v17.46,28.57 21.27,28.57 22.23,29.53 ATMEGA328P-AU.31 | 19.37,40.64 19.75,40.64 20.32,40.64 JP11.4 | v14.61,38.1 16.9,38.1 v17,38
VBAT
  Bottom 0.152: B1.+$1 7.5,50 3.5,50 3.5,33 9.5,27 9.5,20 9.45,19.96 9.45,16.61 7.01,14.17 7.01,11.28 RTC1.6
VCC  (via drill 0.35, 0.6)
  Top 0.152: 38.5,3 U1.5V | 41,5.5 40.96,5.5
  Top 0.254: 40.96,5.4 40.96,5.5 40.96,8.89 S2.3 | J1.2 58.74,15.24 52.7,9.21 S1.3 | JP11.2 16.51,41.59 | J3.1 J3.2 39.69,19.05 | 39.69,19.05 J3.3 | 39.69,19.05 29.84,9.21 S3.3 | v15.24,39.37 13.97,39.37 v12.7,38.1 | v6.48,9.65 6.48,11.94 v5.46,12.95 | v5.08,30.48 3.81,30.48 1.27,33.02 1.27,46.48 1.91,47.12 v6.35,47.12 | 41,5.5 41,5.44 U1.5V | v37.34,6.1 30.86,6.1 v30.48,6.48
  Top 0.305: v29.21,36.83 29.21,38.1 v30.48,39.37 | 16.51,41.59 16.51,43.18 v19.05,45.72 | v24.13,45.72 v31.75,45.72
  Bottom 0.152: 38,3 U1.5V | 30,9 S3.3 29.5,9.5 29,10 8,10 7.5,9.5 7.49,9.53 | 15.25,40.5 16.5,41.75 JP11.2 | 13.25,29.75 ATMEGA328P-AU.18 | R24.2 54.56,21.18 60.66,21.18 62.79,19.05 64.01,19.05 64.77,18.29 64.77,16.46 63.55,15.24 J1.2 | 7.77,8.38 R23.1
  Bottom 0.254: 29.84,8.89 S3.3 30.48,8.46 v30.48,6.48 | S1.3 52.39,9.21 51.12,10.48 42.55,10.48 41.27,9.21 S2.3 | 26.04,36.83 R1.2 | 38.1,46.35 35.56,46.35 | 38.1,46.35 40.64,46.35 R19.2 | 38.1,46.35 R20.2 | 35.56,46.35 34.61,46.35 34.61,45.72 34.61,44.77 34.29,44.45 34.29,42.23 32.38,40.32 30.48,40.32 25.72,40.32 24.77,39.37 C1.1 v22.23,39.37 | 35.56,46.35 R21.2 | 28.89,22.54 28.89,21.59 R14.1 | 28.89,22.54 31.43,22.54 32.38,21.59 | 28.89,22.54 21.91,22.54 | 21.91,22.54 21.27,22.54 20,23.81 ATMEGA328P-AU.6 | 21.91,22.54 21.91,24.45 21.27,25.08 ATMEGA328P-AU.4 | J3.1 35.24,19.37 33.02,19.37 32.38,20 32.38,21.59 | 32.38,21.59 R15.1 | 15.25,40.5 v15.25,39.38 v15.24,39.37 | v12.7,38.1 12.7,30.3 12.75,30.25 12.75,30.14 ATMEGA328P-AU.18 | 7.77,8.38 7.77,9.25 7.49,9.53 6.6,9.53 v6.48,9.65 | v5.46,12.95 5.46,16.52 RTC1.2 R22.1 6.67,20.64 7.62,21.59 7.62,27.94 v5.08,30.48 | v6.35,47.12 17.65,47.12 v19.05,45.72 | 38,3 38,5.43 v37.34,6.1
  Bottom 0.305: 26.04,36.83 v29.21,36.83 | v30.48,39.37 30.48,40.32 | v19.05,45.72 v24.13,45.72 | v31.75,45.72 34.61,45.72

### Text on the board
_tsilk: debug / header | + | + | + | - | - | - | X | GND | 5V | RX | TX | RST | D13 | D17 | Defusable Alarm Clock / Shield for Arduino | v1.0 jan 2017 | + | + | + | - | - | - | Tilt | Y | C | B | A | RTC RST
_bsilk: J.A. Korten / www.jksoftedu.nl